# Altium schematic sheet 74HC595.SchDoc
size A4
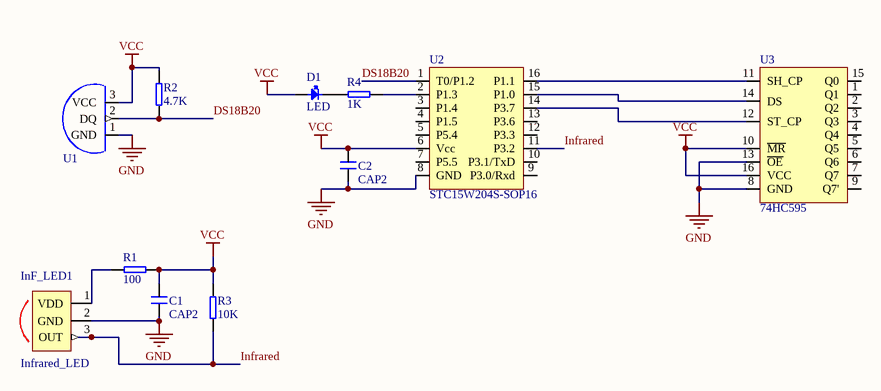
[diagram p0: 74HC595.SchDoc]

## Parts
C1  CAP2  [0805]
C2  CAP2  [0805]
D1  LED  [LED0805]
InF_LED1  Infrared_LED  [IR]
R1  100  [RES0805]
R2  4.7K  [RES0805]
R3  10K  [RES0805]
R4  1K  [RES0805]
U1  DS18B20  [3PIN]  (value not drawn)
U2  STC15W204S-SOP16  [SOP16]
U3  74HC595  [SOP16]

## Nets
GND: C1.1 C2.1 InF_LED1.2(GND) U1.1(GND) U2.8(GND) U3.8(GND) U3.13(~{OE})
VCC: C1.2 C2.2 D1.1(A) R1.2 R2.2 R3.2 U1.3(VCC) U2.6(Vcc) U3.10(~{MR}) U3.16(VCC)
DS18B20: R2.1 U1.2(DQ) U2.1(T0/P1.2)
Infrared: InF_LED1.3(OUT) R3.1 U2.11(P3.2)
NetD1_2: D1.2(K) R4.2
NetInF_LED1_1: InF_LED1.1(VDD) R1.1
NetR4_1: R4.1 U2.2(P1.3)
NetU2_14: U2.14(P3.7) U3.12(ST_CP)
NetU2_15: U2.15(P1.0) U3.14(DS)
NetU2_16: U2.16(P1.1) U3.11(SH_CP)

Not connected (* = marked no-connect by the designer): U2 3(P1.4) 4(P1.5) 5(P5.4) 7(P5.5) 9(P3.0/Rxd) 10(P3.1/TxD) 12(P3.3) 13(P3.6); U3 1(Q1) 2(Q2) 3(Q3) 4(Q4) 5(Q5) 6(Q6) 7(Q7) 9(Q7') 15(Q0)

## Library data of the parts
R1-R4 = RES